# Altium project Pr_note_ada.PrjPcb
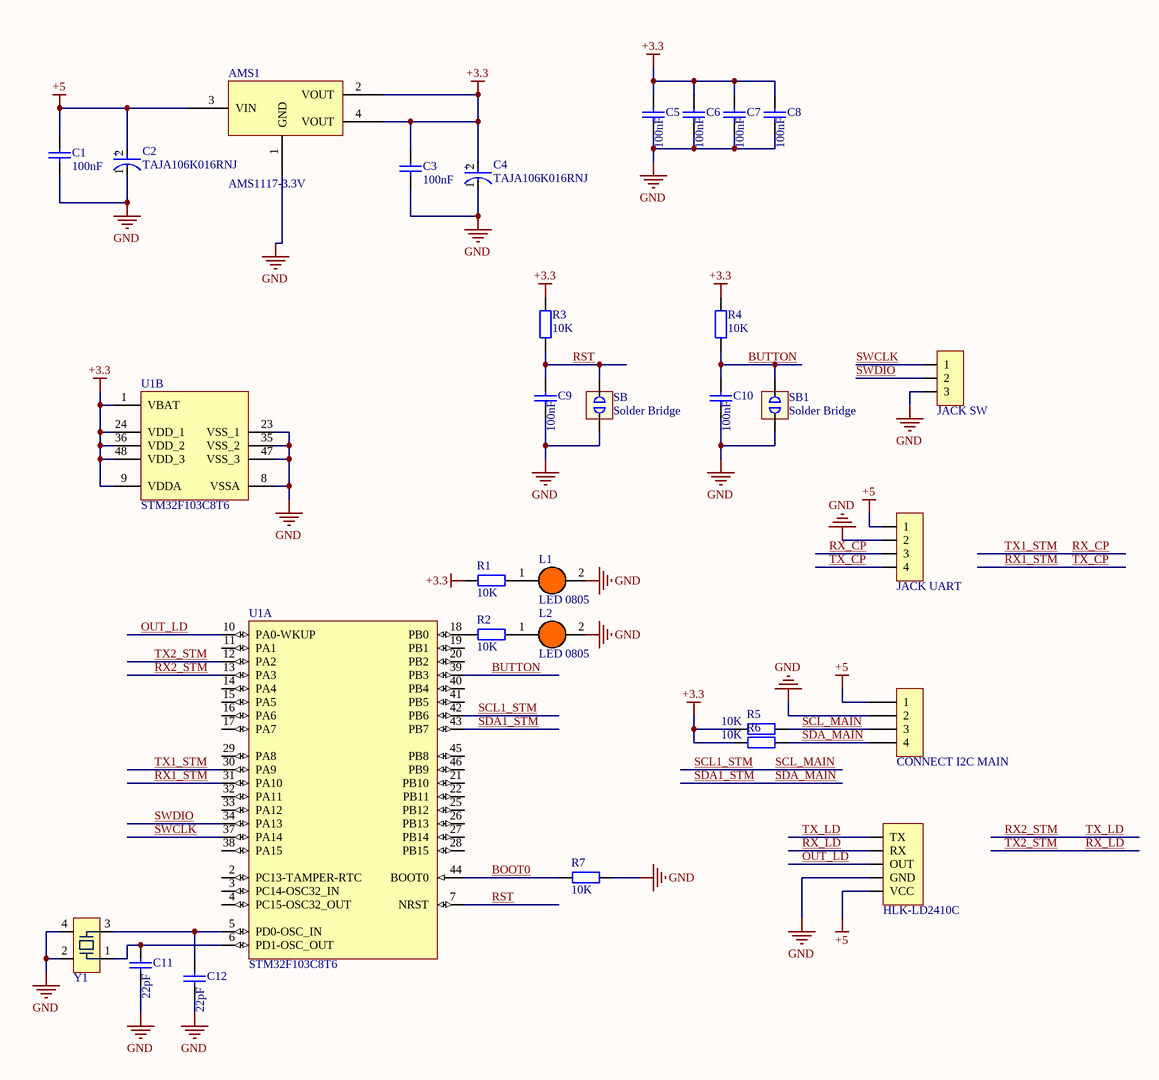
[diagram p0: STM32SchDoc.SchDoc]
1 sheet, 30 parts. Net scope: global (net labels, ports and power ports of the same name join across sheets).
Board file: NODEPcbDoc.PcbDoc

## Sheet STM32SchDoc.SchDoc
size A1; SheetNumber: 1; SheetTotal: 1

### Parts
AMS1  AMS1117-3.3V  [SOT223]
C1  100nF  [tu 0603]
C2  TAJA106K016RNJ  [FP-TAJA-MFG]
C3  100nF  [tu 0603]
C4  TAJA106K016RNJ  [FP-TAJA-MFG]
C5  100nF  [tu 0603]
C6  100nF  [tu 0603]
C7  100nF  [tu 0603]
C8  100nF  [tu 0603]
C9  100nF  [tu 0603]
C10  100nF  [tu 0603]
C11  22pF  [tu 0603]
C12  22pF  [tu 0603]
H1  CONNECT I2C MAIN  [XH2.54M-4]
JP1  JACK SW  [JP 1x3 DT]
JP2  JACK UART  [JP 1x4 DT]
L1  LED 0805  [LED-0805-Orange]
L2  LED 0805  [LED-0805-Orange]
R1  10K  [tro smd 0603]
R2  10K  [tro smd 0603]
R3  10K  [tro smd 0603]
R4  10K  [tro smd 0603]
R5  10K  [tro smd 0603]
R6  10K  [tro smd 0603]
R7  10K  [tro smd 0603]
SB  Solder Bridge  [SB2_NO]  (no BOM)
SB1  Solder Bridge  [SB2_NO]  (no BOM)
U1  STM32F103C8T6  [48-LQFP]  (parts A,B of 2)
U2  HLK-LD2410C  [LD2410C]
Y1  8MHz  [XTAL_3225]  (value not drawn)

### Nets
+3.3: AMS1.2(VOUT) AMS1.4(VOUT) C3.1 C4.2(A) C5.1 C6.1 C7.1 C8.1 R1.1 R3.2 R4.2 R5.1 R6.1 U1.1(VBAT) U1.9(VDDA) U1.24(VDD_1) U1.36(VDD_2) U1.48(VDD_3)
+5: AMS1.3(VIN) C1.1 C2.2(A) H1.1 JP2.1 U2.5(VCC)
GND: AMS1.1(GND) C1.2 C2.1(C) C3.2 C4.1(C) C5.2 C6.2 C7.2 C8.2 C9.2 C10.2 C11.2 C12.2 H1.2 JP1.3 JP2.2 L1.2(K) L2.2(K) R7.2 SB.1 SB1.1 U1.8(VSSA) U1.23(VSS_1) U1.35(VSS_2) U1.47(VSS_3) U2.4(GND) Y1.2 Y1.4
BOOT0: R7.1 U1.44(BOOT0)
BUTTON: C10.1 R4.1 SB1.2 U1.39(PB3)
OUT_LD: U1.10(PA0-WKUP) U2.3(OUT)
RST: C9.1 R3.1 SB.2 U1.7(NRST)
RX1_STM: JP2.4 U1.31(PA10)  [also labelled TX_CP]
RX2_STM: U1.13(PA3) U2.1(TX)  [also labelled TX_LD]
RX_CP: JP2.3 U1.30(PA9)  [also labelled TX1_STM]
RX_LD: U1.12(PA2) U2.2(RX)  [also labelled TX2_STM]
SCL1_STM: H1.3 R5.2 U1.42(PB6)  [also labelled SCL_MAIN]
SDA1_STM: H1.4 R6.2 U1.43(PB7)  [also labelled SDA_MAIN]
SWCLK: JP1.1 U1.37(PA14)
SWDIO: JP1.2 U1.34(PA13)
NetC11_1: C11.1 U1.6(PD1-OSC_OUT) Y1.1
NetC12_1: C12.1 U1.5(PD0-OSC_IN) Y1.3
NetL1_1: L1.1(A) R1.2
NetL2_1: L2.1(A) R2.2
NetR2_1: R2.1 U1.18(PB0)

Not connected (* = marked no-connect by the designer): U1 2(PC13-TAMPER-RTC) 3(PC14-OSC32_IN) 4(PC15-OSC32_OUT) 11(PA1) 14(PA4) 15(PA5) 16(PA6) 17(PA7) 19(PB1) 20(PB2) 21(PB10) 22(PB11) 25(PB12) 26(PB13) 27(PB14) 28(PB15) 29(PA8) 32(PA11) 33(PA12) 38(PA15) 40(PB4) 41(PB5) 45(PB8) 46(PB9)

### Notes on the sheet
- (in symbol CMP-1661-00004-2) +

### Library data of the parts
AMS1 = AMS1117 SMD: Dán; Value: AMS1117-3.3V SOT223; Don_Vi: Con; Ma_Hang: MH000596; Ghi_Chu: *; Kieu_Chan: *; Chung_Loai: Dán
C1 C3 C5-C12 = Tu 0603 102 50V 10%: Dán; Don_Vi: Con; So_Chan: 2; Ten_Linh_Kien: Tụ 0603 102-1nF 10% 50V; Ma_Hang: MH004566; Chung_Loai: Dán; Kieu_Chan: *
C2 C4 = CMP-1661-00004-2: 10uF 16V  ±10% 3Ω 1206  SMD Tantalum Capacitor; ESR (Equivalent Series Resistance): 3R; Leakage Current: 1.6uA; Dissipation Factor: 8%; Polarity: Polar; Length: 3.2mm; Features: General Purpose; Voltage Rating: 16V; Voltage: 16V; Mount: Surface Mount; Case/Package: 1206; Number of Pins: 2; Case Code (Metric): 3216; Radiation Hardening: No; Min Operating Temperature: -55°C; Case Code (Imperial): 1206; Height - Seated (Max): 0.071inch; Lead Free: Lead Free; Termination: SMD/SMT; Dielectric Material: Tantalum; Width: 1.6mm; Tolerance: 10%; Capacitance: 10uF; Lead Pitch: 1.1mm; Max Operating Temperature: 125°C; Voltage Rating (DC): 16V; Packaging: Tape and Reel; Package Quantity: 1; REACH SVHC: No SVHC; Depth: 1.6mm; Height: 1.6mm
H1 = Header 4P 2.54 Duc Thang: Cắm; Ten_Linh_Kien: Header 4P XH2.54-4P Đực Thẳng; Don_Vi: Con; Ma_Hang: MH001285; Chung_Loai: Cắm
JP1 = JP 1x3 2.54 Duc Thang: Cắm; Ten_Linh_Kien: Jump Đơn Đực 2.54MM 1x40P Thẳng 11MM; Don_Vi: Con; Ma_Hang: MH000903; Ghi_Chu: *; Kieu_Chan: *; Chung_Loai: Cắm
JP2 = JP 1x4 2.54 Duc Thang: Cắm; Ten_Linh_Kien: Jump Đơn Đực 2.54MM 1x40P Thẳng 11MM; Don_Vi: Con; Ma_Hang: MH000903; Ghi_Chu: *; Kieu_Chan: *; Chung_Loai: Cắm
L1 L2 = LED 0805 Cam: Dán; Don_Vi: Con; Ma_Hang: MH002328; Ten_Linh_Kien: LED 0805 Màu Cam ( Orange); Ghi_Chu: *; Kieu_Chan: *; Chung_Loai: Dán
R1-R7 = Tro 0603 1% 0R: Dán; Don_Vi: Con; So_Chan: 2; Ten_Linh_Kien: Trở 0603 1% 0R; Ma_Hang: MH005792; Chung_Loai: Dán; Kieu_Chan: *
SB SB1 = SB 2 NO: Solder Bridge 2; Solder: Not Fill; Value: Solder Bridge
U1 = STM32F103C8T6: IC MCU 32BIT 64KB FLASH 48LQFP; Part number: STMicroelectronics; Manufacturer: STM32F103C8T6; Cost: 33000; Package: 64-LQFP; ComponentLink1Description: Link product; Supplier 1: Future Electronics
U2 = HLK-LD2410C: HLK-LD2410C  LD2410C mmWave Sensor
Y1 = XTAL_8MHZ_4_PIN: XTAL 8MHZ 4 PIN SMD 3225; Manufacturer: NDK; Part number: XTAL_4_3225; Cost: 6000; ComponentLink1Description: Link product; ComponentLink1URL: https://www.thegioiic.com/thach-anh-8mhz-3225-4-chan-smd; Package: 3225